# EasyEDA schematic Dronmarket Controller.json

## Sheets
1 Cpu Sheet: TITLE: STM32F103C8T6原理图; REV: 1.0; Date: 2016-12-31; Sheet: 1/1; Drawn By: Phoebus
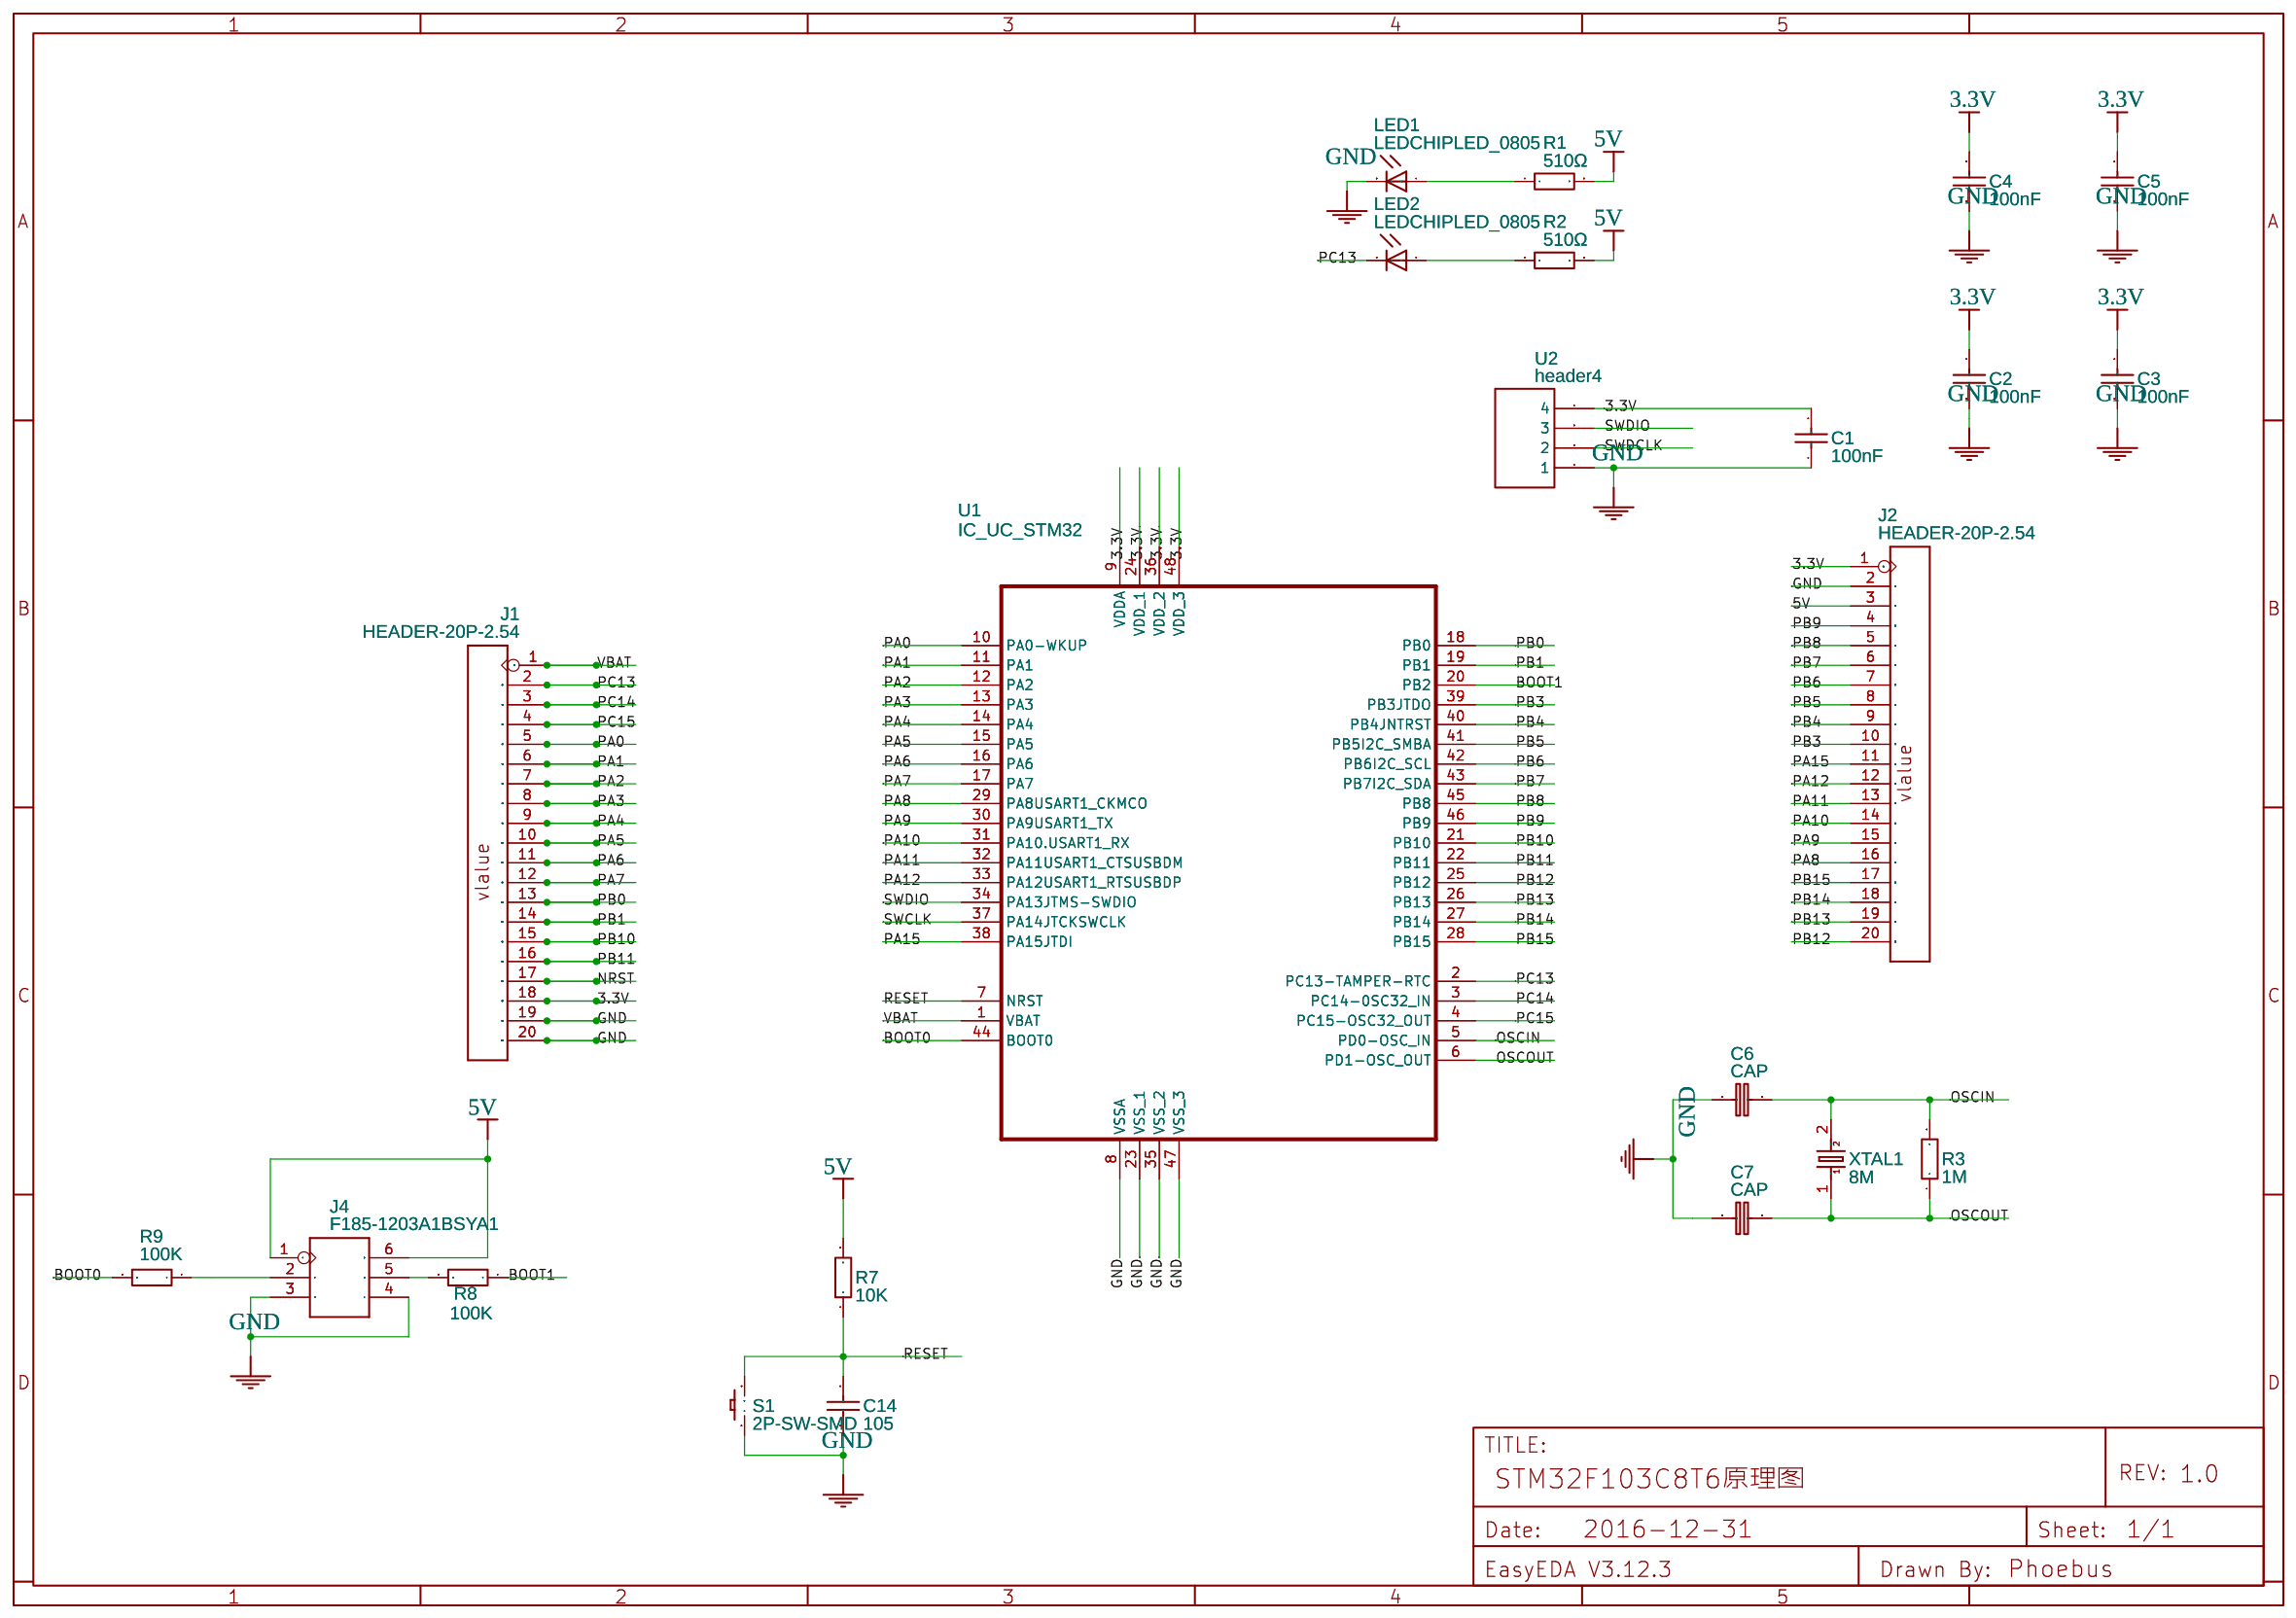
[diagram p0: Cpu Sheet]
2 Power Sheet: TITLE: Sheet_3; Date: 2020-06-09; Company: Your Company
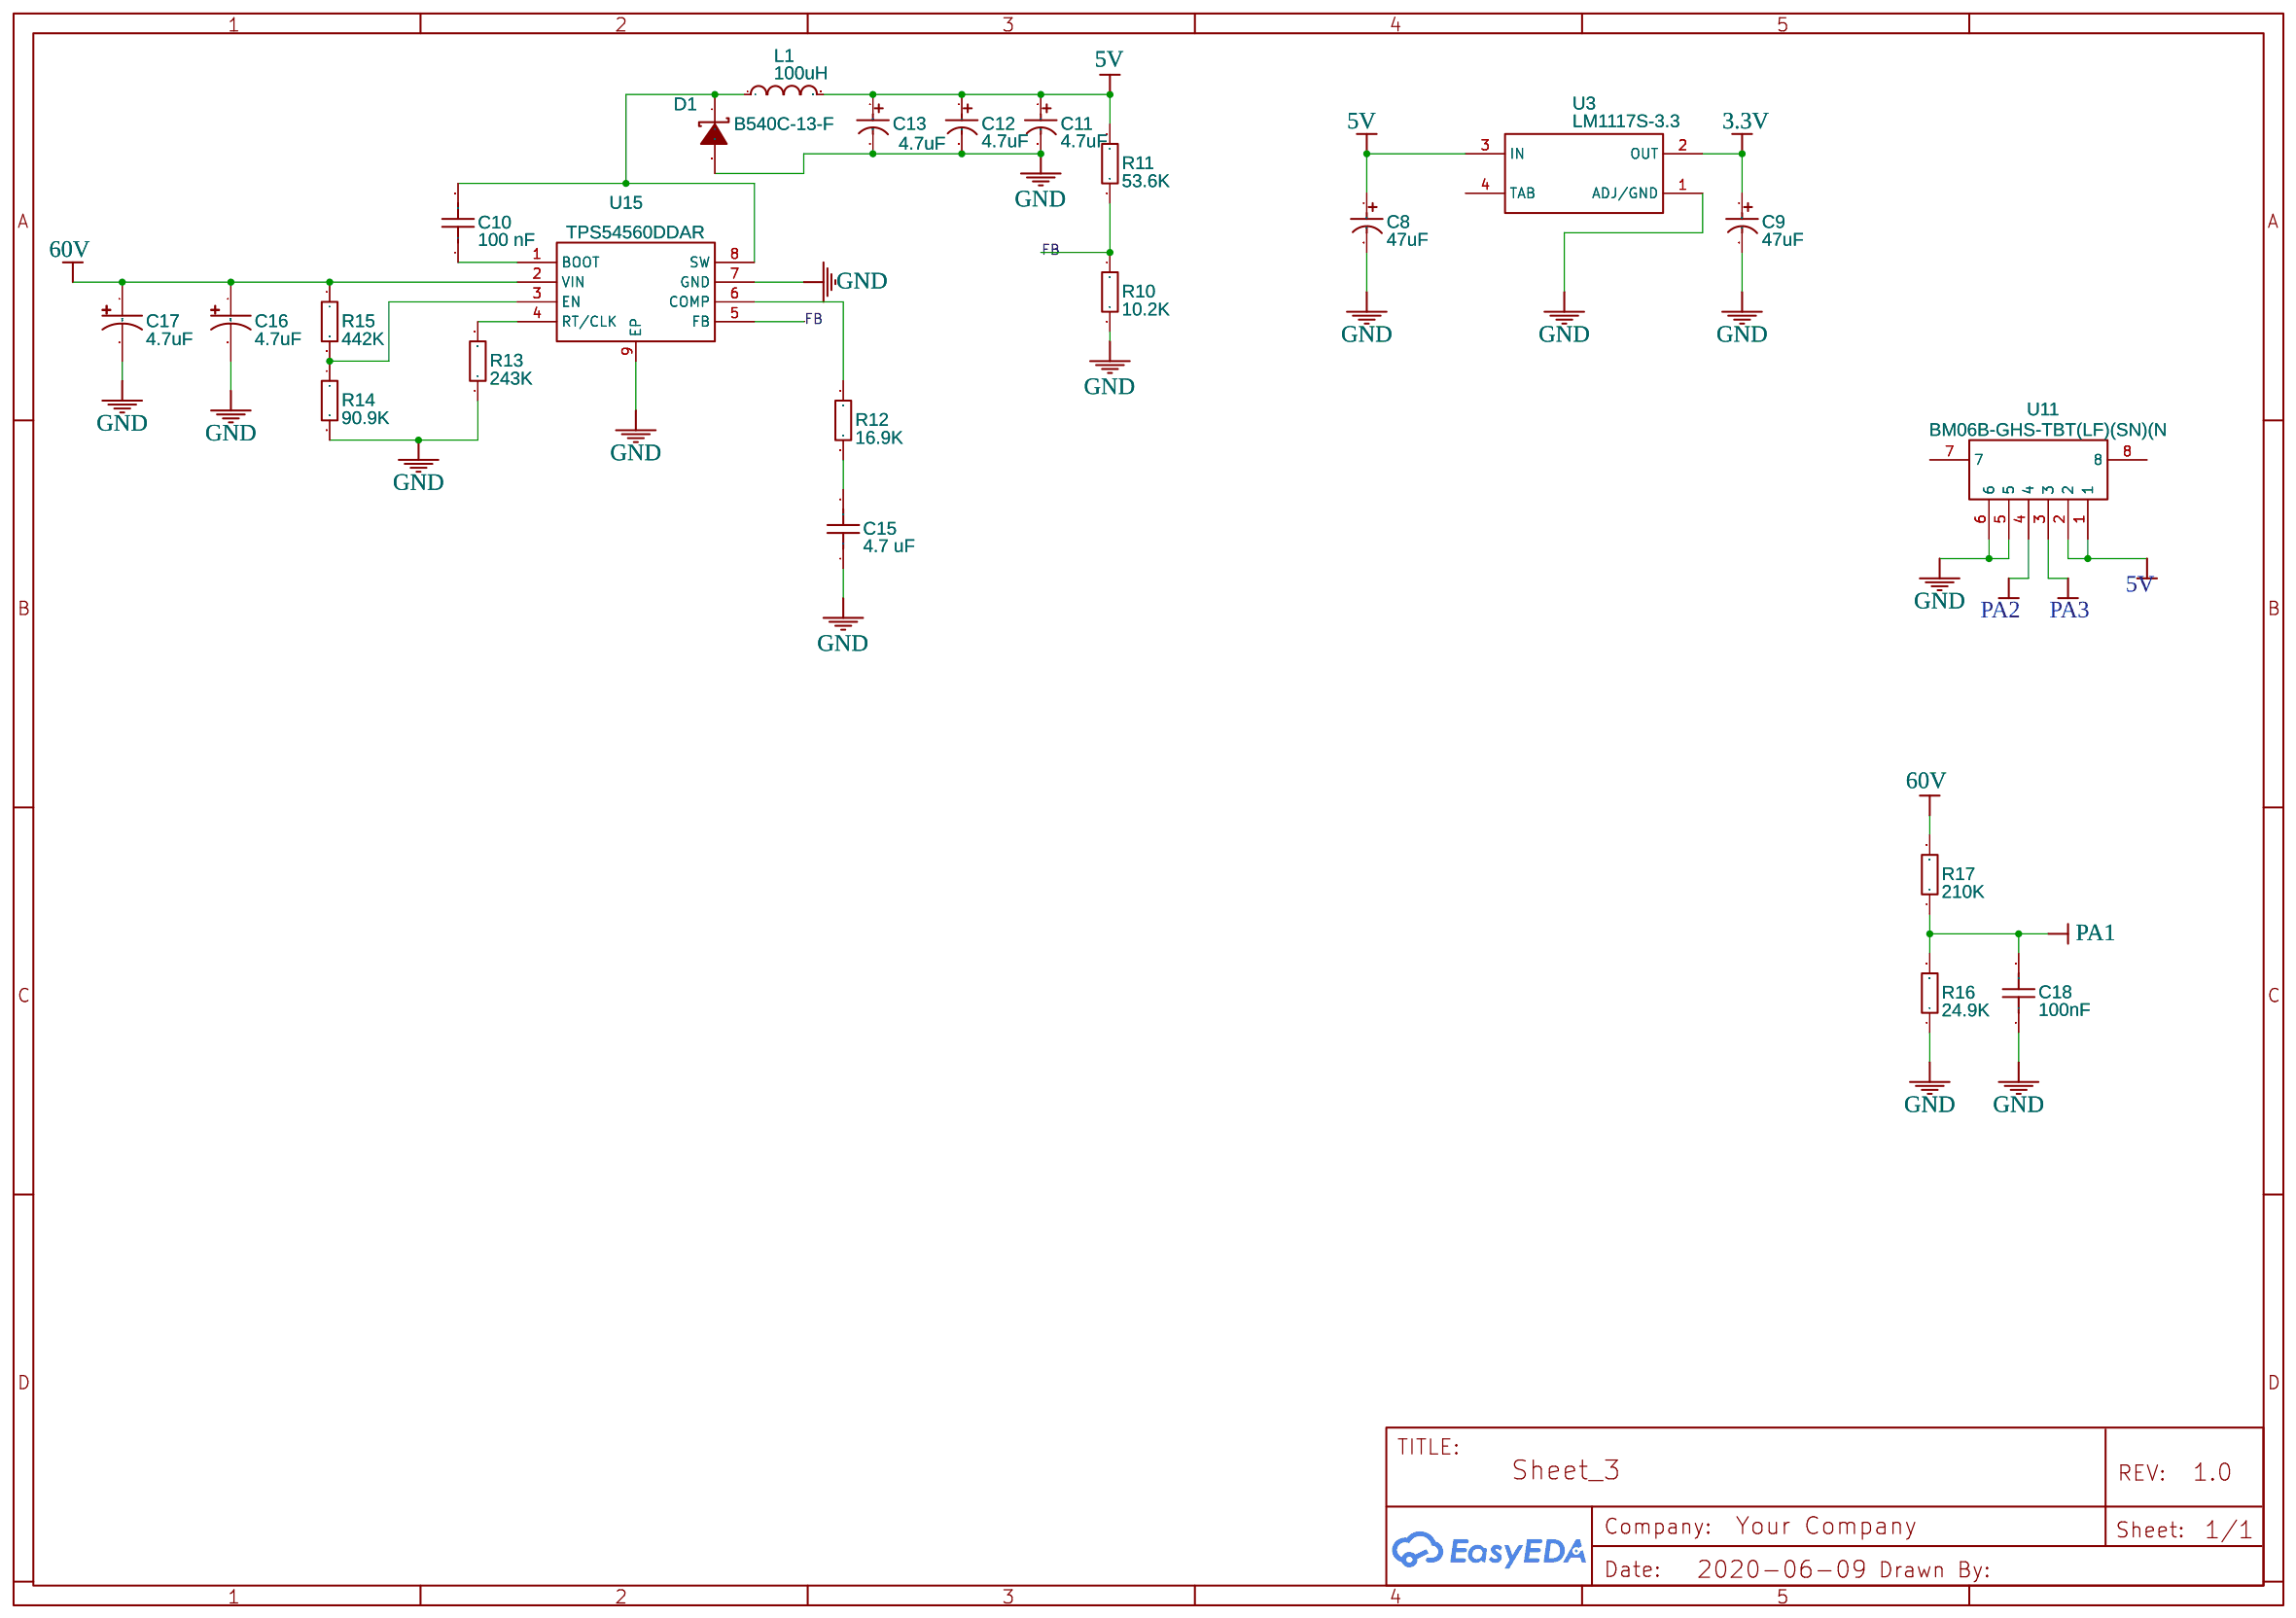
[diagram p1: Power Sheet]
3 Comminication Sheet: TITLE: Sheet_1; Date: 2020-06-09; Company: Your Company
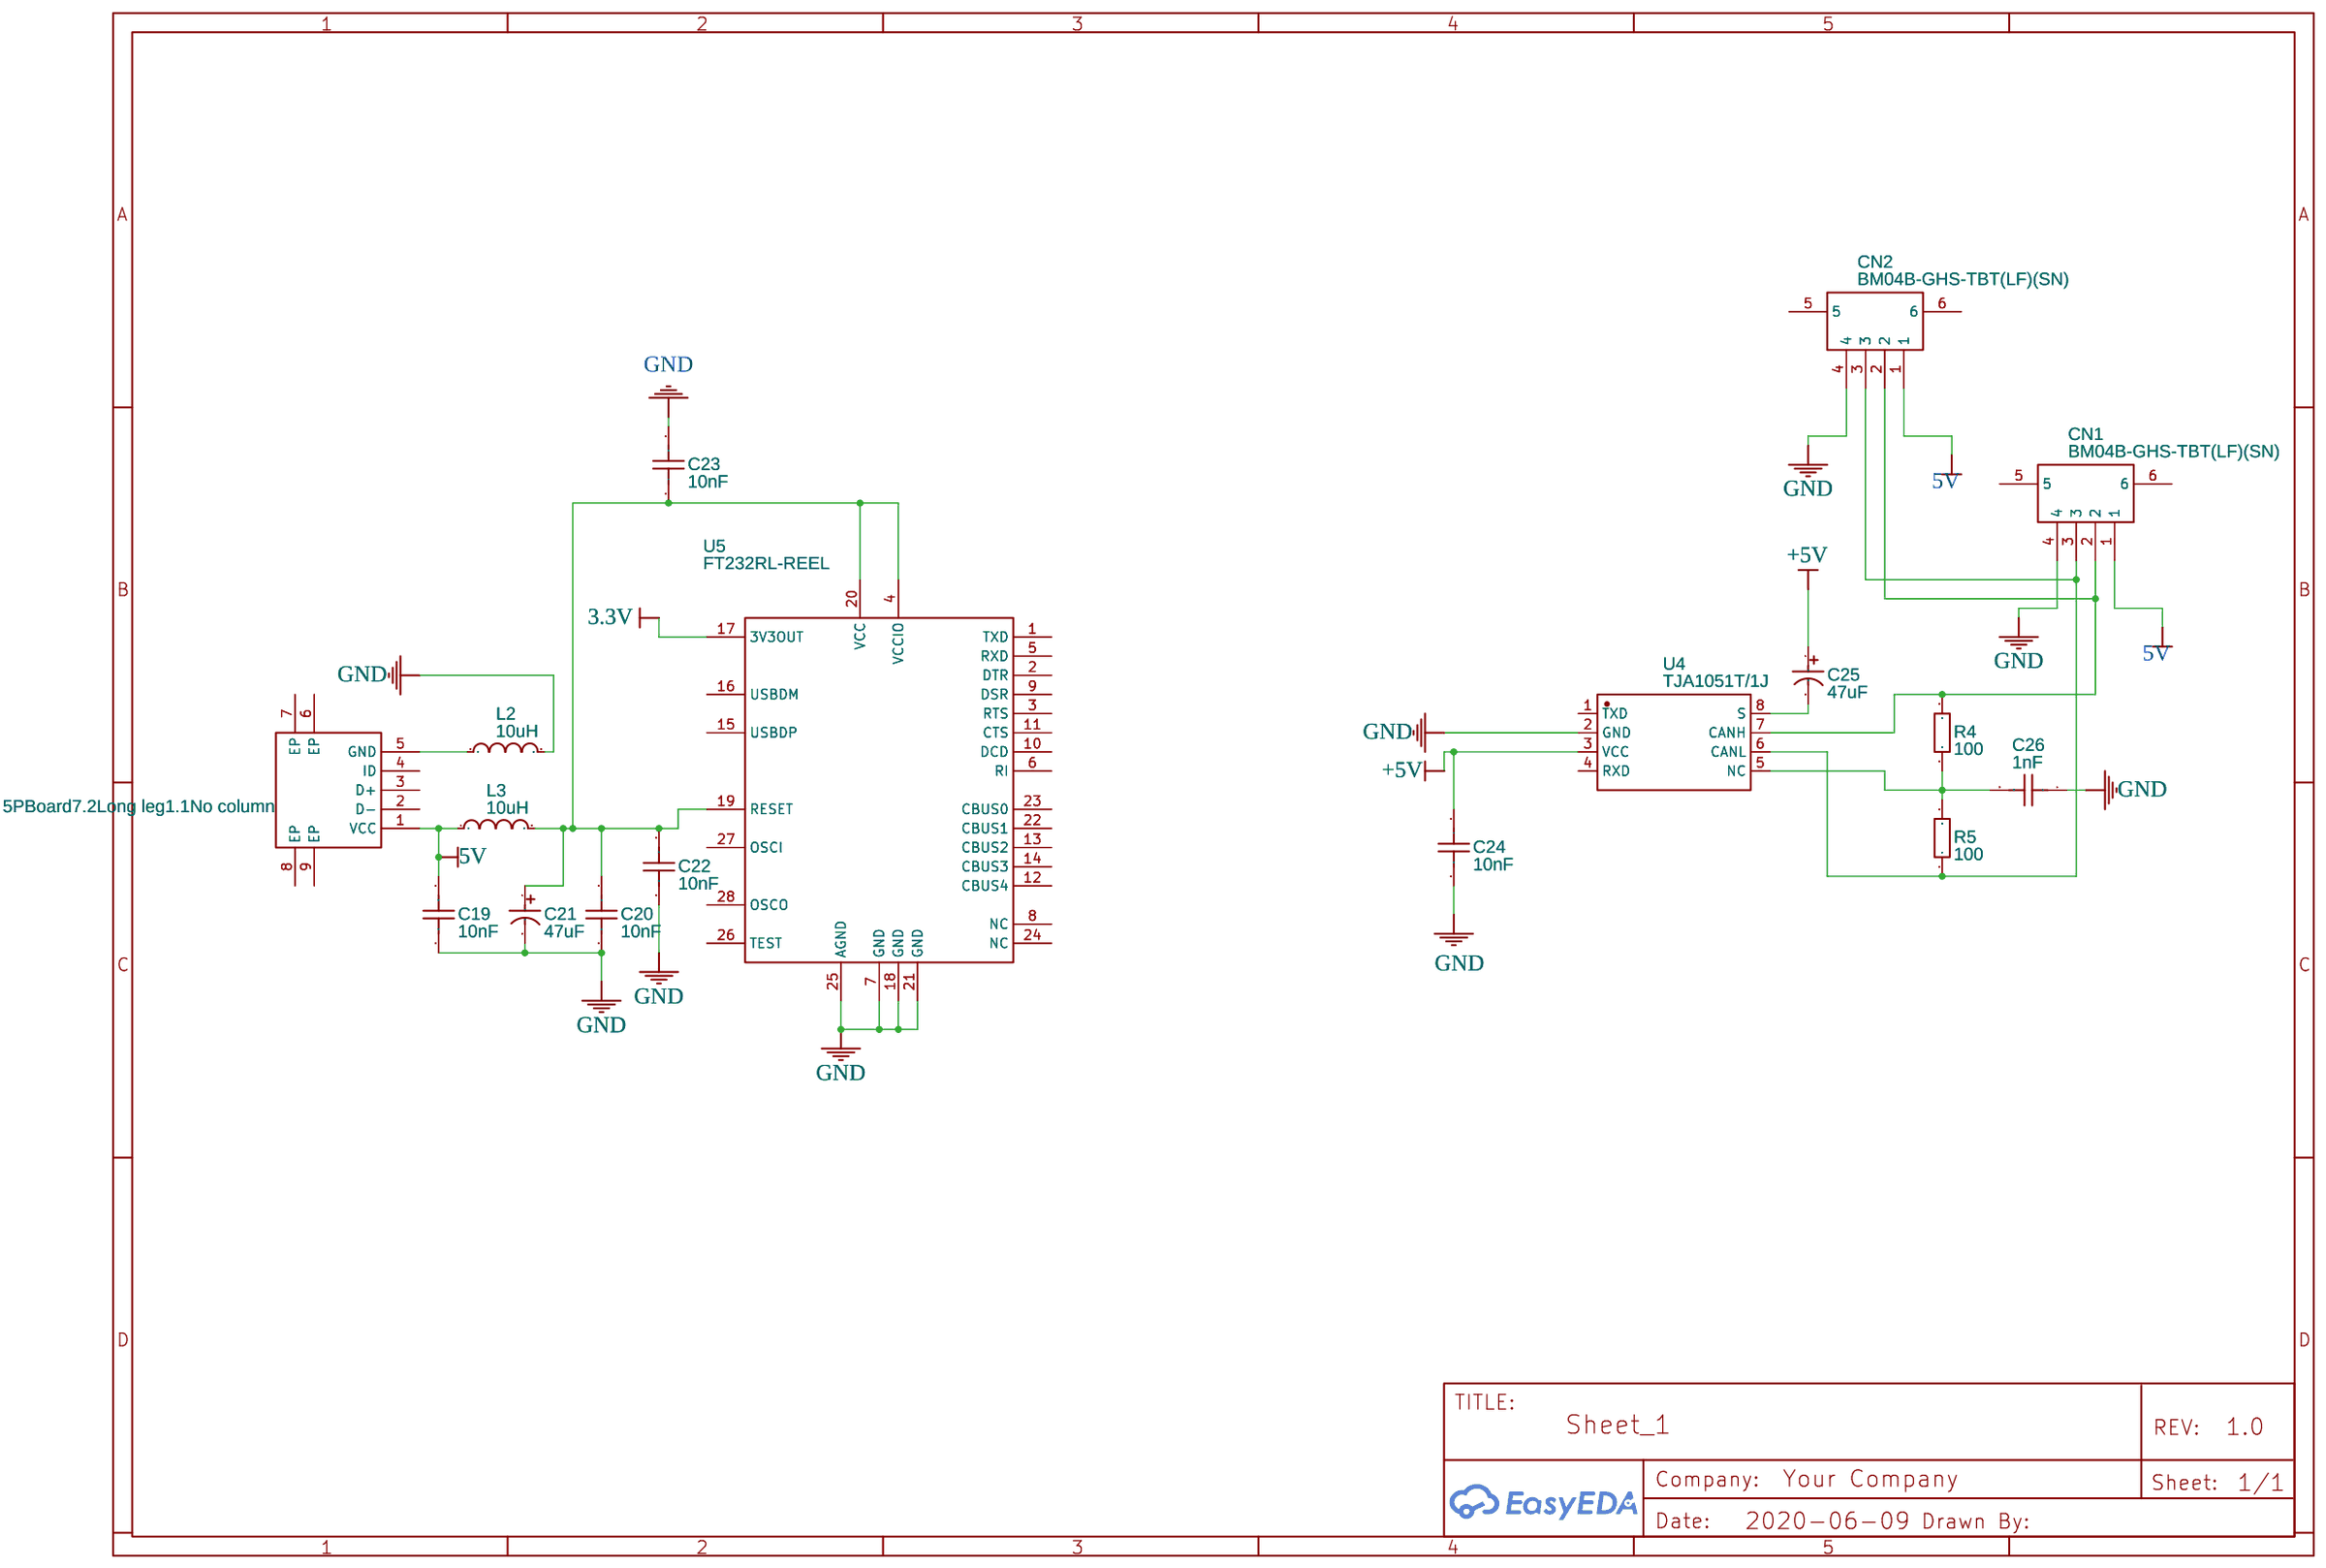
[diagram p2: Comminication Sheet]
4 Sbus&PWM: TITLE: Sheet_1; Date: 2020-06-09; Company: Your Company
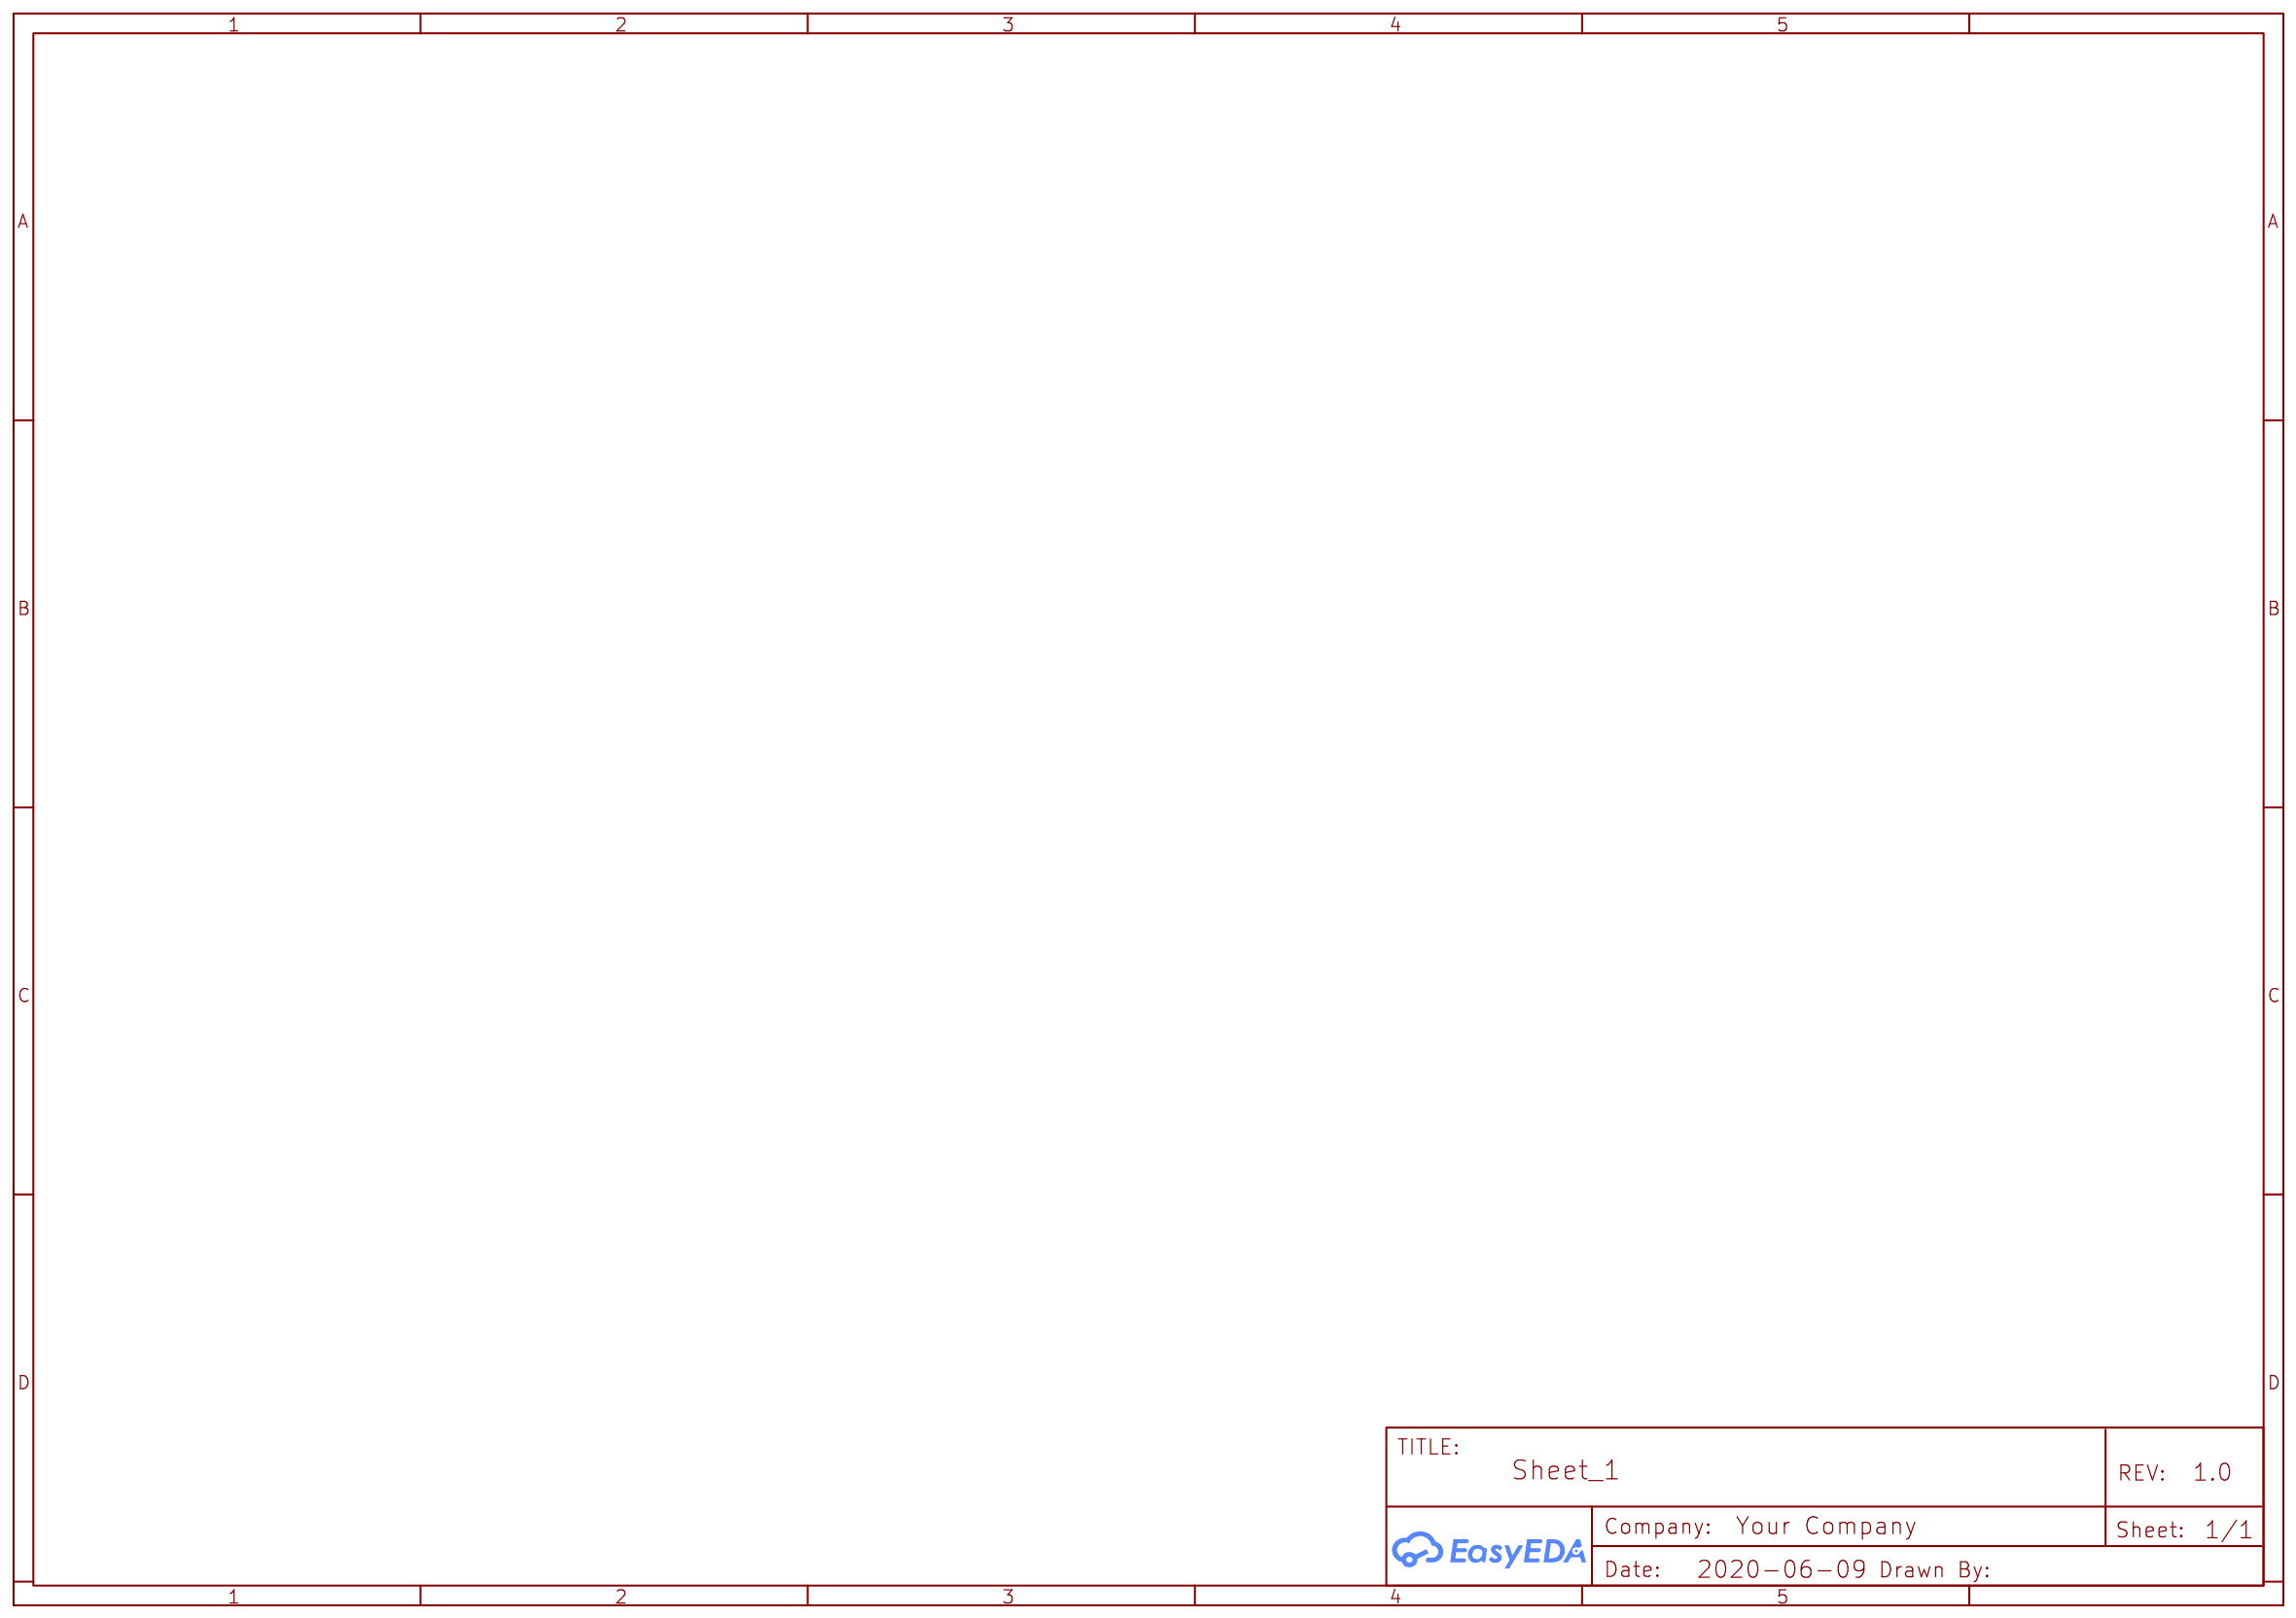
[diagram p3: Sbus&PWM]

## Parts
sheet Comminication Sheet
C19  10nF  [C0805]
C20  10nF  [C0805]
C21  47uF  [CAP-SMD_L3.2-W1.6-R-RD]
C22  10nF  [C0805]
C23  10nF  [C0805]
C24  10nF  [C0805]
C25  47uF  [CAP-SMD_L3.2-W1.6-R-RD]
C26  1nF  [C0805]
CN1  BM04B-GHS-TBT(LF)(SN)  [CONN-SMD_4P-P1.25_BM04B-GHS-TBT(LF)(SN)]
CN2  BM04B-GHS-TBT(LF)(SN)  [CONN-SMD_4P-P1.25_BM04B-GHS-TBT(LF)(SN)]
L2  10uH  [L0805]
L3  10uH  [L0805]
R4  100  [R0805]
R5  100  [R0805]
U4  TJA1051T/1J  [SOIC-8_L4.9-W3.9-P1.27-LS6.0-BL]
U5  FT232RL-REEL  [SSOP-28_L10.2-W5.3-P0.65-LS7.8-BL]
USB2  micro 5PBoard7.2Long leg1.1No column  [MICRO-USB-SMD_U-F-M5DS-Y-1]
sheet Cpu Sheet
C1  100nF  [0603]
C2  100nF  [0603]
C3  100nF  [0603]
C4  100nF  [0603]
C5  100nF  [0603]
C6  CAP  [0603-CAP]
C7  CAP  [0603-CAP]
C14  105  [0603]
J1  HEADER-20P-2.54  [H20-2.54]
J2  HEADER-20P-2.54  [H20-2.54]
J4  F185-1203A1BSYA1  [H2X3-2.54]
LED1  LEDCHIPLED_0805  [CHIPLED_0805]
LED2  LEDCHIPLED_0805  [CHIPLED_0805]
R1  510Ω  [0603]
R2  510Ω  [0603]
R3  1M  [0603]
R7  10K  [0603]
R8  100K  [0603]
R9  100K  [0603]
S1  2P-SW-SMD  [2PSW-SMD]
U1  IC_UC_STM32  [LQFP48]
U2  header4  [H4-2.54]
XTAL1  8M  [HC-49U]
sheet Power Sheet
C8  47uF  [CAP-SMD_L3.2-W1.6-R-RD]
C9  47uF  [CAP-SMD_L3.2-W1.6-R-RD]
C10  100 nF  [C0805]
C11  4.7uF  [CAP-SMD_BD4.0-L4.3-W4.3-FD]
C12  4.7uF  [CAP-SMD_BD4.0-L4.3-W4.3-FD]
C13  4.7uF  [CAP-SMD_BD4.0-L4.3-W4.3-FD]
C15  4.7 uF  [C0805]
C16  4.7uF  [CAP-SMD_BD5.0-L5.3-W5.3-FD]
C17  4.7uF  [CAP-SMD_BD5.0-L5.3-W5.3-FD]
C18  100nF  [C0805]
D1  B540C-13-F  [SMC_L6.9-W5.9-LS7.9-RD]
L1  100uH  [IND-SMD_L12.0-W12.0]
R10  10.2K  [R0805]
R11  53.6K  [R0805]
R12  16.9K  [R0805]
R13  243K  [R0805]
R14  90.9K  [R0805]
R15  442K  [R0805]
R16  24.9K  [R0805]
R17  210K  [R0805]
U3  LM1117S-3.3  [SOT-223-3_L6.5-W3.4-P2.30-LS7.0-BR]
U11  BM06B-GHS-TBT(LF)(SN)(N  [CONN-SMD_6P-P1.25_BM06B-GHS-TBT(LF)(SN)(N]
U15  TPS54560DDAR  [SOIC-8_L5.0-W4.0-P1.27-LS6.0-BL-EP]

## Library data of the parts
C19 C20 C22-C24 C26 = 0805B103K500: Supplier: LCSC; Manufacturer: WTC; Supplier Part: C83058
C8 C9 C21 C25 = TLJA476M010R0600: Supplier: LCSC; Supplier Part: C131173; Manufacturer: AVX; Contributor: LCSC; LCSC Assembly: Yes; SMT Type: Extend
CN1 CN2 = BM04B-GHS-TBT(LF)(SN): Supplier: LCSC; Supplier Part: C161692; Manufacturer: JST Sales America; Contributor: LCSC
L2 L3 = CI2012C100K(F): Supplier: LCSC; Supplier Part: C111772; Manufacturer: Shenzhen Zhenhua Fu Elec; Manufacturer Part: CI2012C100K(f); Contributor: LCSC
R4 R5 = 0805W8J0101T5E: Supplier: LCSC; Manufacturer: UniOhm; Supplier Part: C25277
U4 = TJA1051T/1J: Supplier: LCSC; Manufacturer: NXP; Contributor: LCSC; Supplier Part: C92211; LCSC Assembly: Yes; SMT Type: Extend
U5 = FT232RL-REEL: Supplier: LCSC; Manufacturer: FTDI; LCSC Assembly: Yes; image: //image.lceda.cn/szlcsc/C8690.jpg; Supplier Part: C8690; SMT Type: Basic
USB2 = micro 5PBoard7.2Long leg1.1No column: Supplier: LCSC; Manufacturer: ValuePro; Supplier Part: C40951
C1-C5 C14 = -: Voltage: 50V; Tolerance: ±10%; Supplier: EasyEDA; Manufacturer: FH; Manufacturer Part: 0603B104K500NT; Supplier Part: E30926
C6 C7 = -: catid: 20; Contributor: SparkFun; Manufacturer Part: ?
J1 J2 S1 = -: catid: 20; Manufacturer Part: ?
J4 = -: DIP Black Female Header VERT; catid: 20; Supplier: SeeedStudio; Supplier Part: 320030011
LED1 LED2 = -: LED; catid: 20; Contributor: Adafruit; Manufacturer Part: ?
R1-R3 R7-R9 = -: Power: 1/10W; Tolerance: ±1%; Supplier: EasyEDA; Manufacturer: UniOhm; Manufacturer Part: 0603WAF5100T5E; Supplier Part: E23193
U1 = -: STM32F102C6; catid: 20; Contributor: DangerousPrototype; Manufacturer Part: ?
U2 = -: Contributor: victor_chen; Manufacturer Part: ?
XTAL1 = -: catid: 20; Contributor: DangerousPrototype; Manufacturer Part: ?
C10 C15 C18 = TCC0805X7R104K500DT: Supplier: LCSC; Supplier Part: C282732; Manufacturer: CCTC; Contributor: LCSC
C11-C13 = CS1C4R7M-CRC54: Supplier: LCSC; Manufacturer: SEMTECH; Contributor: LCSC; Supplier Part: C116396
C16 C17 = EEEFK1J4R7R: Supplier: LCSC; Supplier Part: C264058; Manufacturer: PANASONIC; Contributor: LCSC
D1 = B540C-13-F: Supplier: LCSC; Manufacturer: DIODES; Supplier Part: C72264; LCSC Assembly: Yes; SMT Type: Extend
L1 = SLH1204S101MTT: Supplier: LCSC; Supplier Part: C397808; Manufacturer: Sunltech Tech; Contributor: LCSC
R10-R15 = RMC080510K1%N: Supplier: LCSC; Supplier Part: C269742; Manufacturer: Tyohm; Contributor: LCSC
R16 = 0805W8F2492T5E: Supplier: LCSC; Manufacturer: UniOhm; Supplier Part: C17571; LCSC Assembly: Yes; SMT Type: Extend
R17 = 0805W8F2103T5E: Supplier: LCSC; Manufacturer: UniOhm; Supplier Part: C17547; LCSC Assembly: Yes; SMT Type: Extend
U3 = LM1117S-3.3: Supplier: LCSC; Manufacturer: HTC; Supplier Part: C126027; LCSC Assembly: Yes; SMT Type: Extend
U11 = BM06B-GHS-TBT(LF)(SN)(N: Supplier: LCSC; Supplier Part: C189892; Manufacturer: JST Sales America; Contributor: LCSC
U15 = TPS54560DDAR: Supplier: LCSC; Manufacturer: TI; image: //image.lceda.cn/szlcsc/C31966.jpg; Supplier Part: C31966; LCSC Assembly: Yes; SMT Type: Extend

## Nets
3.3V: C1.2 C2.2 C3.2 C4.2 C5.2 C9.1 J1.18(P$18) J2.1(P$1) U1.9(VDDA) U1.24(VDD_1) U1.36(VDD_2) U1.48(VDD_3) U2.4 U3.2(OUT) U5.17(3V3OUT)
5V: C8.1 C11.1 C12.1 C13.1 C19.2 CN1.1 CN2.1 J2.3(P$3) J4.1 J4.6 L1.2 L3.1 R1.2 R2.2 R7.2 R11.1 U3.3(IN) U11.1 U11.2 USB2.1(VCC)
60V: C16.1 C17.1 R15.1 R17.2 U15.2(VIN)
+5V: C24.2 C25.1 U4.3(VCC)
GND: C1.1 C2.1 C3.1 C4.1 C5.1 C6.1 C7.1 C8.2 C9.2 C11.2 C12.2 C13.2 C14.1 C15.1 C16.2 C17.2 C18.1 C19.1 C20.1 C21.2 C22.1 C23.2 C24.1 C26.1 CN1.4 CN2.4 D1.2(A) J1.19(P$19) J1.20(P$20) J2.2(P$2) J4.3 J4.4 L2.2 LED1.C R10.2 R13.1 R14.2 R16.1 S1.2(1) U1.8(VSSA) U1.23(VSS_1) U1.35(VSS_2) U1.47(VSS_3) U2.1 U3.1(ADJ/GND) U4.2(GND) U5.7(GND) U5.18(GND) U5.21(GND) U5.25(AGND) U11.5 U11.6 U15.7(GND) U15.9(EP)
VBAT: J1.1(P$1) U1.1(VBAT)
BOOT0: R9.2 U1.44(BOOT0)
BOOT1: R8.1 U1.20(PB2)
FB: R10.1 R11.2 U15.5(FB)
NRST: J1.17(P$17)
OSCIN: C6.2 R3.2 U1.5(PD0-OSC_IN) XTAL1.2
OSCOUT: C7.2 R3.1 U1.6(PD1-OSC_OUT) XTAL1.1
PA0: J1.5(P$5) U1.10(PA0-WKUP)
PA1: C18.2 J1.6(P$6) R16.2 R17.1 U1.11(PA1)
PA2: J1.7(P$7) U1.12(PA2) U11.4
PA3: J1.8(P$8) U1.13(PA3) U11.3
PA4: J1.9(P$9) U1.14(PA4)
PA5: J1.10(P$10) U1.15(PA5)
PA6: J1.11(P$11) U1.16(PA6)
PA7: J1.12(P$12) U1.17(PA7)
PA8: J2.16(P$16) U1.29(PA8USART1_CKMCO)
PA9: J2.15(P$15) U1.30(PA9USART1_TX)
PA10: J2.14(P$14) U1.31(PA10.USART1_RX)
PA11: J2.13(P$13) U1.32(PA11USART1_CTSUSBDM)
PA12: J2.12(P$12) U1.33(PA12USART1_RTSUSBDP)
PA15: J2.11(P$11) U1.38(PA15JTDI)
PB0: J1.13(P$13) U1.18(PB0)
PB1: J1.14(P$14) U1.19(PB1)
PB3: J2.10(P$10) U1.39(PB3JTDO)
PB4: J2.9(P$9) U1.40(PB4JNTRST)
PB5: J2.8(P$8) U1.41(PB5I2C_SMBA)
PB6: J2.7(P$7) U1.42(PB6I2C_SCL)
PB7: J2.6(P$6) U1.43(PB7I2C_SDA)
PB8: J2.5(P$5) U1.45(PB8)
PB9: J2.4(P$4) U1.46(PB9)
PB10: J1.15(P$15) U1.21(PB10)
PB11: J1.16(P$16) U1.22(PB11)
PB12: J2.20(P$20) U1.25(PB12)
PB13: J2.19(P$19) U1.26(PB13)
PB14: J2.18(P$18) U1.27(PB14)
PB15: J2.17(P$17) U1.28(PB15)
PC13: J1.2(P$2) LED2.C U1.2(PC13-TAMPER-RTC)
PC14: J1.3(P$3) U1.3(PC14-0SC32_IN)
PC15: J1.4(P$4) U1.4(PC15-OSC32_OUT)
RESET: C14.2 R7.1 S1.3(2) U1.7(NRST)
SWCLK: U1.37(PA14JTCKSWCLK)
SWDCLK: U2.2
SWDIO: U1.34(PA13JTMS-SWDIO) U2.3
Net-(C10-1): C10.1 U15.1(BOOT)
Net-(C10-2): C10.2 D1.1(K) L1.1 U15.8(SW)
Net-(C15-2): C15.2 R12.2
Net-(C20-2): C20.2 C21.1 C22.2 C23.1 L3.2 U5.4(VCCIO) U5.19(RESET) U5.20(VCC)
Net-(C25-2): C25.2 U4.8(S)
Net-(C26-2): C26.2 R4.1 R5.2 U4.5(NC)
Net-(CN1-2): CN1.2 CN2.2 R4.2 U4.7(CANH)
Net-(CN1-3): CN1.3 CN2.3 R5.1 U4.6(CANL)
Net-(J4-2): J4.2 R9.1
Net-(J4-5): J4.5 R8.2
Net-(L2-1): L2.1 USB2.5(GND)
Net-(LED1-A): LED1.A R1.1
Net-(LED2-A): LED2.A R2.1
Net-(R12-1): R12.1 U15.6(COMP)
Net-(R13-2): R13.2 U15.4(RT/CLK)
Net-(R14-1): R14.1 R15.2 U15.3(EN)

Not connected (* = marked no-connect by the designer): CN1 5 6; CN2 5 6; U3 4(TAB); U4 1(TXD) 4(RXD); U5 1(TXD) 2(DTR) 3(RTS) 5(RXD) 6(RI) 8(NC) 9(DSR) 10(DCD) 11(CTS) 12(CBUS4) 13(CBUS2) 14(CBUS3) 15(USBDP) 16(USBDM) 22(CBUS1) 23(CBUS0) 24(NC) 26(TEST) 27(OSCI) 28(OSCO); U11 7 8; USB2 2(D-) 3(D+) 4(ID) 6(EP) 7(EP) 8(EP) 9(EP)
